# Altium schematic sheet Sheet1.SchDoc
size 400 x 500 mm; SheetNumber: 1; SheetTotal: 1; SPICEModelCacheBADZOKST: <root> / <DocumentId>BADZOKST</DocumentId> / <CacheFrame Number="0"> / <Model Name="cap" Kind="MDL"> / <Text>*Default semiconductor capacitor / .MODEL CAP C()</Text> / </Model> / </CacheFrame> / </root>
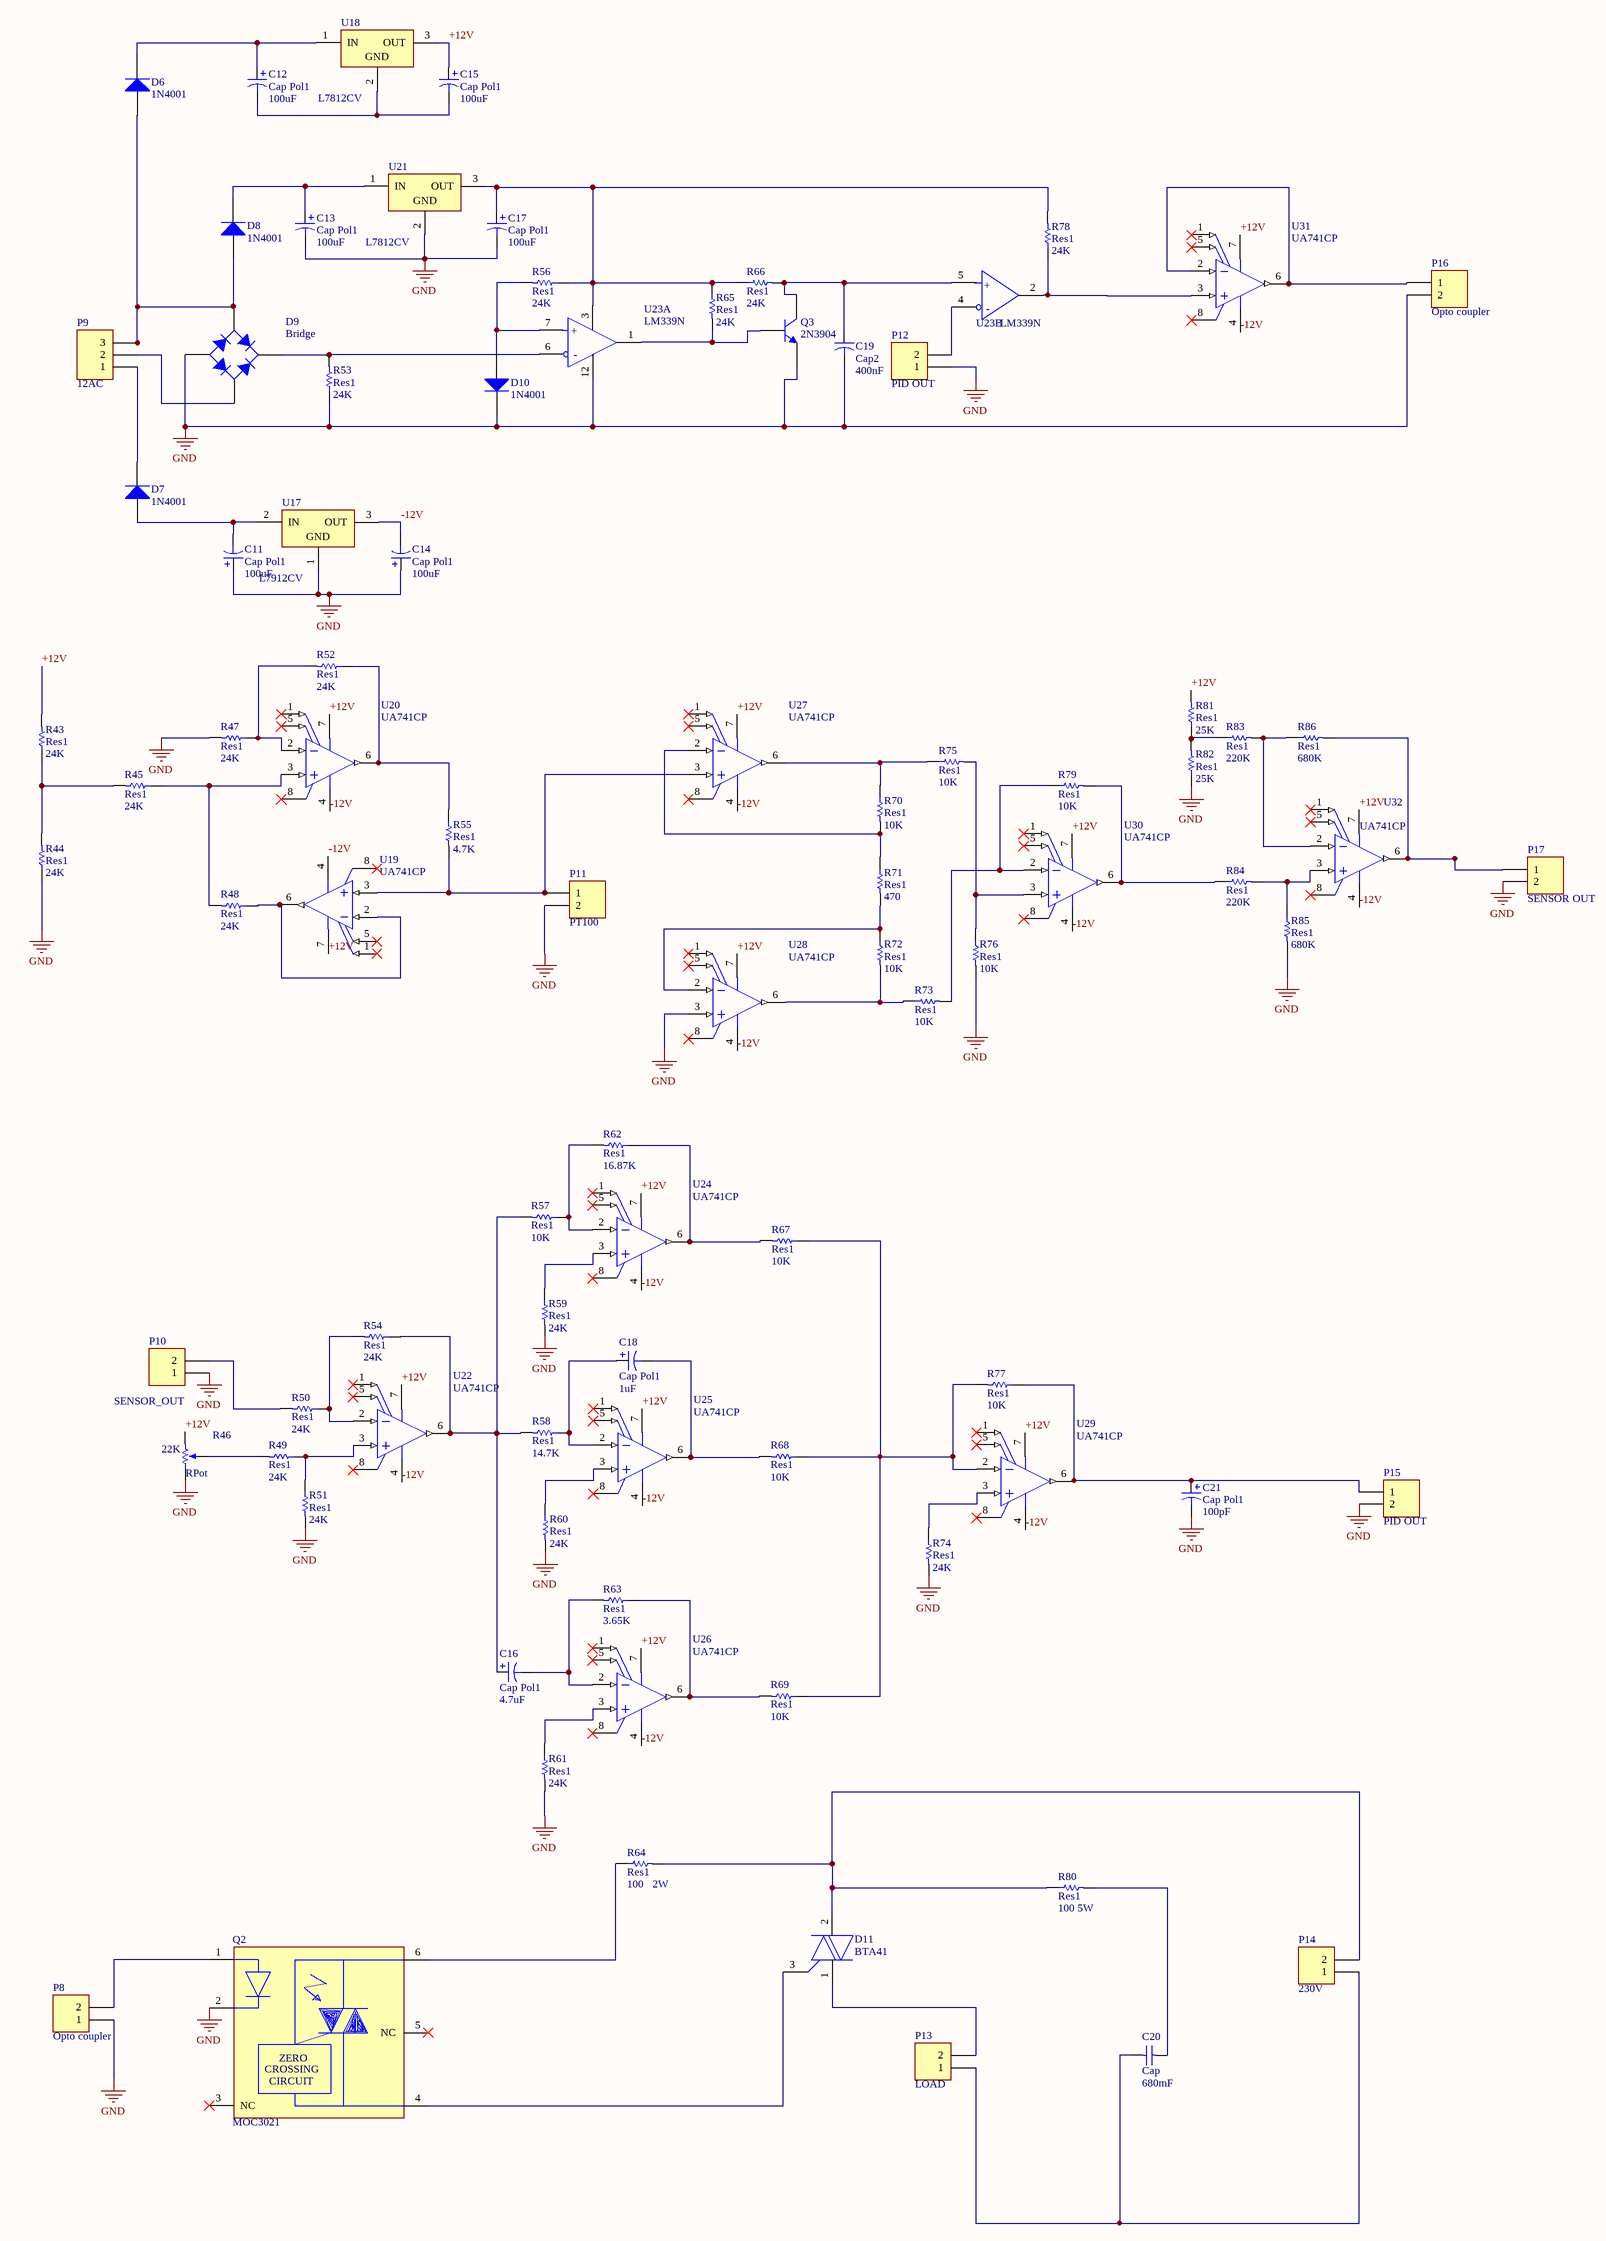
[diagram p0: Sheet1.SchDoc]

## Parts
C11  Cap Pol1  value 100uF  [RB7.6-15]
C12  Cap Pol1  value 100uF  [RB7.6-15]
C13  Cap Pol1  value 100uF  [RB7.6-15]
C14  Cap Pol1  value 100uF  [RB7.6-15]
C15  Cap Pol1  value 100uF  [RB7.6-15]
C16  Cap Pol1  value 4.7uF  [RB7.6-15]
C17  Cap Pol1  value 100uF  [RB7.6-15]
C18  Cap Pol1  value 1uF  [RB7.6-15]
C19  Cap2  value 400nF  [CAPR5-4X5]
C20  Cap  value 680mF  [RAD-0.3]
C21  Cap Pol1  value 100pF  [RB7.6-15]
D6  1N4001  [DO-41]
D7  1N4001  [DO-41]
D8  1N4001  [DO-41]
D9  Bridge  [D-38]
D10  1N4001  [DO-41]
D11  BTA41  [FP-TO-220AB-MFG]
P8  Opto coupler  [HDR1X2]
P9  12AC  [HDR1X3]
P10  SENSOR_OUT  [HDR1X2]
P11  PT100  [HDR1X2]
P12  PID OUT  [HDR1X2]
P13  LOAD  [HDR1X2]
P14  230V  [HDR1X2]
P15  PID OUT  [HDR1X2]
P16  Opto coupler  [HDR1X2]
P17  SENSOR OUT  [HDR1X2]
Q2  MOC3021  [FP-646BX-MFG]
Q3  2N3904  [ONSC-TO-92-3-29-11]
R43  Res1  value 24K  [AXIAL-0.3]
R44  Res1  value 24K  [AXIAL-0.3]
R45  Res1  value 24K  [AXIAL-0.3]
R46  RPot  value 22K  [VR5]
R47  Res1  value 24K  [AXIAL-0.3]
R48  Res1  value 24K  [AXIAL-0.3]
R49  Res1  value 24K  [AXIAL-0.3]
R50  Res1  value 24K  [AXIAL-0.3]
R51  Res1  value 24K  [AXIAL-0.3]
R52  Res1  value 24K  [AXIAL-0.3]
R53  Res1  value 24K  [AXIAL-0.3]
R54  Res1  value 24K  [AXIAL-0.3]
R55  Res1  value 4.7K  [AXIAL-0.3]
R56  Res1  value 24K  [AXIAL-0.3]
R57  Res1  value 10K  [AXIAL-0.3]
R58  Res1  value 14.7K  [AXIAL-0.3]
R59  Res1  value 24K  [AXIAL-0.3]
R60  Res1  value 24K  [AXIAL-0.3]
R61  Res1  value 24K  [AXIAL-0.3]
R62  Res1  value 16.87K  [AXIAL-0.3]
R63  Res1  value 3.65K  [AXIAL-0.3]
R64  Res1  value 100   2W  [AXIAL-0.3]
R65  Res1  value 24K  [AXIAL-0.3]
R66  Res1  value 24K  [AXIAL-0.3]
R67  Res1  value 10K  [AXIAL-0.3]
R68  Res1  value 10K  [AXIAL-0.3]
R69  Res1  value 10K  [AXIAL-0.3]
R70  Res1  value 10K  [AXIAL-0.3]
R71  Res1  value 470  [AXIAL-0.3]
R72  Res1  value 10K  [AXIAL-0.3]
R73  Res1  value 10K  [AXIAL-0.3]
R74  Res1  value 24K  [AXIAL-0.3]
R75  Res1  value 10K  [AXIAL-0.3]
R76  Res1  value 10K  [AXIAL-0.3]
R77  Res1  value 10K  [AXIAL-0.3]
R78  Res1  value 24K  [AXIAL-0.3]
R79  Res1  value 10K  [AXIAL-0.3]
R80  Res1  value 100 5W  [AXIAL-0.3]
R81  Res1  value 25K  [AXIAL-0.3]
R82  Res1  value 25K  [AXIAL-0.3]
R83  Res1  value 220K  [AXIAL-0.3]
R84  Res1  value 220K  [AXIAL-0.3]
R85  Res1  value 680K  [AXIAL-0.3]
R86  Res1  value 680K  [AXIAL-0.3]
U17  L7912CV  [TO-220]
U18  L7812CV  [TO220]
U19  UA741CP  [P0008A]
U20  UA741CP  [P0008A]
U21  L7812CV  [TO220]
U22  UA741CP  [P0008A]
U23  LM339N  [FP-N0014A-MFG]  (parts A,B of 4)
U24  UA741CP  [P0008A]
U25  UA741CP  [P0008A]
U26  UA741CP  [P0008A]
U27  UA741CP  [P0008A]
U28  UA741CP  [P0008A]
U29  UA741CP  [P0008A]
U30  UA741CP  [P0008A]
U31  UA741CP  [P0008A]
U32  UA741CP  [P0008A]

## Nets
GND: C11.1 C13.2 C14.1 C17.2 C19.2 C21.2 D9.3(A) D10.2(K) P8.1 P10.1 P11.2 P12.1 P15.2 P16.2 P17.2 Q2.2(C) Q3.1(C) R44.1 R46.1(TOP) R47.2 R51.2 R53.1 R59.2 R60.2 R61.2 R74.2 R76.2 R82.1 R85.2 U17.1(GND) U21.2(GND) U23.12(GND) U28.3(IN+)
+12V: C15.1 R43.2 R46.2(BOT) R81.2 U18.3(OUT) U19.7(VCC+) U20.7(VCC+) U22.7(VCC+) U24.7(VCC+) U25.7(VCC+) U26.7(VCC+) U27.7(VCC+) U28.7(VCC+) U29.7(VCC+) U30.7(VCC+) U31.7(VCC+) U32.7(VCC+)
-12V: C14.2 U17.3(OUT) U19.4(VCC-) U20.4(VCC-) U22.4(VCC-) U24.4(VCC-) U25.4(VCC-) U26.4(VCC-) U27.4(VCC-) U28.4(VCC-) U29.4(VCC-) U30.4(VCC-) U31.4(VCC-) U32.4(VCC-)
NetC11_2: C11.2 D7.1(A) U17.2(IN)
NetC12_1: C12.1 D6.2(K) U18.1(IN)
NetC12_2: C12.2 C15.2 U18.2(GND)
NetC13_1: C13.1 D8.2(K) U21.1(IN)
NetC16_1: C16.1 R54.1 R57.2 R58.2 U22.6(OUT)
NetC16_2: C16.2 R63.2 U26.2(IN-)
NetC17_1: C17.1 R56.1 R65.1 R66.1 R78.2 U21.3(OUT) U23.3(VCC)
NetC18_1: C18.1 R58.1 U25.2(IN-)
NetC18_2: C18.2 R68.2 U25.6(OUT)
NetC19_1: C19.1 Q3.3(E) R66.2 U23.5(2IN+)
NetC20_1: C20.1 P13.1 P14.1
NetC20_2: C20.2 R80.2
NetC21_1: C21.1 P15.1 R77.1 U29.6(OUT)
NetD6_1: D6.1(A) D8.1(A) D9.4(C) P9.3
NetD7_2: D7.2(K) P9.1
NetD9_1: D9.1(K) R53.2 U23.6(1IN-)
NetD9_2: D9.2(C) P9.2
NetD10_1: D10.1(A) R56.2 U23.7(1IN+)
NetD11_1: D11.1(A1) P13.2
NetD11_2: D11.2(A2) P14.2 R64.2 R80.1
NetD11_3: D11.3(G) Q2.4(1_MAIN_TERM.)
NetP8_2: P8.2 Q2.1(A)
NetP10_2: P10.2 R50.2
NetP11_1: P11.1 R55.2 U19.3(IN+) U27.3(IN+)
NetP12_2: P12.2 U23.4(2IN-)
NetP16_1: P16.1 U31.2(IN-) U31.6(OUT)
NetP17_1: P17.1 R86.2 U32.6(OUT)
NetQ2_6: Q2.6(2_MAIN_TERM.) R64.1
NetQ3_2: Q3.2(B) R65.2 U23.1(1OUT)
NetR43_1: R43.1 R44.2 R45.2
NetR45_1: R45.1 R48.2 U20.3(IN+)
NetR46_3: R46.3(TAP) R49.2
NetR47_1: R47.1 R52.2 U20.2(IN-)
NetR48_1: R48.1 U19.2(IN-) U19.6(OUT)
NetR49_1: R49.1 R51.1 U22.3(IN+)
NetR50_1: R50.1 R54.2 U22.2(IN-)
NetR52_1: R52.1 R55.1 U20.6(OUT)
NetR57_1: R57.1 R62.2 U24.2(IN-)
NetR59_1: R59.1 U24.3(IN+)
NetR60_1: R60.1 U25.3(IN+)
NetR61_1: R61.1 U26.3(IN+)
NetR62_1: R62.1 R67.2 U24.6(OUT)
NetR63_1: R63.1 R69.2 U26.6(OUT)
NetR67_1: R67.1 R68.1 R69.1 R77.2 U29.2(IN-)
NetR70_1: R70.1 R75.1 U27.6(OUT)
NetR70_2: R70.2 R71.1 U27.2(IN-)
NetR71_2: R71.2 R72.1 U28.2(IN-)
NetR72_2: R72.2 R73.1 U28.6(OUT)
NetR73_2: R73.2 R79.1 U30.2(IN-)
NetR74_1: R74.1 U29.3(IN+)
NetR75_2: R75.2 R76.1 U30.3(IN+)
NetR78_1: R78.1 U23.2(2OUT) U31.3(IN+)
NetR79_2: R79.2 R84.1 U30.6(OUT)
NetR81_1: R81.1 R82.2 R83.1
NetR83_2: R83.2 R86.1 U32.2(IN-)
NetR84_2: R84.2 R85.1 U32.3(IN+)

Not connected (* = marked no-connect by the designer): Q2 3(NC)* 5(NC)*; U19 1(OFFSET_N1)* 5(OFFSET_N2)* 8(NC)*; U20 1(OFFSET_N1)* 5(OFFSET_N2)* 8(NC)*; U22 1(OFFSET_N1)* 5(OFFSET_N2)* 8(NC)*; U24 1(OFFSET_N1)* 5(OFFSET_N2)* 8(NC)*; U25 1(OFFSET_N1)* 5(OFFSET_N2)* 8(NC)*; U26 1(OFFSET_N1)* 5(OFFSET_N2)* 8(NC)*; U27 1(OFFSET_N1)* 5(OFFSET_N2)* 8(NC)*; U28 1(OFFSET_N1)* 5(OFFSET_N2)* 8(NC)*; U29 1(OFFSET_N1)* 5(OFFSET_N2)* 8(NC)*; U30 1(OFFSET_N1)* 5(OFFSET_N2)* 8(NC)*; U31 1(OFFSET_N1)* 5(OFFSET_N2)* 8(NC)*; U32 1(OFFSET_N1)* 5(OFFSET_N2)* 8(NC)*

## Notes on the sheet
- (in symbol CMP-0055-00143-4, part A) +; -
- (in symbol CMP-0055-00143-4, part B) +; -
- (in symbol CMP-07144-000005-1) ZERO; CROSSING; CIRCUIT

## Library data of the parts
C11-C18 C21 = Cap Pol1: Polarized Capacitor (Radial); Published: 8-Jun-2000; LatestRevisionDate: 17-Jul-2002; LatestRevisionNote: Re-released for DXP Platform.; PackageReference: RB7.6-15; Publisher: Altium Limited; PackageDescription: Polarized Capacitor (Radial); 2 Leads
C19 = Cap2: Capacitor; Published: 23-Sep-2002; PackageReference: CAPR5-4X5; Publisher: Altium Limited; PackageDescription: Capacitor; 2 Leads
C20 = Cap: Capacitor; Published: 8-Jun-2000; LatestRevisionDate: 17-Jul-2002; LatestRevisionNote: Re-released for DXP Platform.; PackageReference: RAD-0.3; Publisher: Altium Limited; PackageDescription: Radial Cap, Thru-Hole; 2 Leads; 0.3 in Pin Spacing
D6-D8 D10 = Diode 1N4001: 1 Amp General Purpose Rectifier; Published: 8-Jun-2000; LatestRevisionDate: 17-Jul-2002; LatestRevisionNote: Re-released for DXP Platform.; DatasheetVersion: 1998; PackageVersion: Aug-1999; PackageReference: DO-41; Publisher: Altium Limited; PackageDescription: Diode, Axial; Body 5.2 x 2.7 mm (LxDia. max), Lead Dia. 0.86 mm (max); Code_JEDEC: DO-204-AL; ComponentLink1Description: Manufacturer Link; ComponentLink1URL: http://www.fairchildsemi.com/; ComponentLink2Description: Datasheet; ComponentLink2URL: http://www.fairchildsemi.com/ds/1N%2F1N4001.pdf
D9 = Bridge1: Full Wave Diode Bridge; Published: 8-Jun-2000; LatestRevisionDate: 29-May-2009; LatestRevisionNote: Sch pins A & K swapped.; DatasheetVersion: E2732B; PackageReference: D-38; Publisher: Altium Limited; PackageDescription: Bridge Rectifier; 4 Terminals; Body 9.4 x 9.4 mm (typ); Pitch 5.08 mm
D11 = CMP-12193-000008-1: TRIAC ALTERNISTOR 600V TO220AB; Manufacturer: STMicroelectronics; Manufacturer Part Number: BTA24-600BWRG; On State Current Rms: 25A; Max Junction Temp: +125°C; Hold Current: 75mA; Gate Trigger Voltage: 1.3V; Gate Trigger Current: 50mA; Standoff Height: 3.75mm; Forward Voltage: 1.55V; Off State Voltage: 600V; Category: Diode; Temperature Range Low: -40°C; ComponentLink2URL: https://www.st.com/resource/en/datasheet/bta24.pdf; Temperature: -40°C to +125°C; ComponentLink2Description: Datasheet; Automotive: No; Lead Free: Yes; Mouser Description: Triacs 25 Amp 600 Volt; Temperature Range High: +125°C; Digikey Description: TRIAC ALTERNISTOR 600V TO220AB; Octopart: https://octopart.com/bta24-600bwrg-stmicroelectronics-360258; RoHS: TRUE; Device Class L2: Thyristors; Height: 19.65mm; Device Class L1: Discrete Semiconductors; Device Class L3: TRIACs; Package: TO-220AB
P8 P10-P17 = Header 2: Header, 2-Pin; LatestRevisionDate: 17-Jul-2002; LatestRevisionNote: Re-released for DXP Platform.; Publisher: Altium Limited
P9 = Header 3: Header, 3-Pin; LatestRevisionDate: 17-Jul-2002; LatestRevisionNote: Re-released for DXP Platform.; Publisher: Altium Limited
Q2 = CMP-07144-000005-1: OPTOISOLATOR 4.17KV TRIAC 6DIP; Manufacturer Part Number: MOC3041M; Manufacturer: ON Semiconductor; Forward Voltage: 1.25V; Power Dissipation: 250mW; Forward Current: 30mA; Reverse Voltage: 6V; Max Junction Temp: +100°C; Isolation Voltage: 4170Vrms; Standoff Height: 0.38mm; Octopart: https://octopart.com/moc3041m-on+semiconductor-84330395; Temperature Range Low: -40°C; Category: Trans; Package: 646BX; Height: 5.08mm; ComponentLink2Description: Datasheet; Device Class L2: Optocouplers; Device Class L1: Optoelectronics; Device Class L3: unset; Automotive: No; RoHS: TRUE; Mouser Description: Optocoupler Triac AC Output 1 Channel 400VDRM 6-Pin Plastic Dip White Bulk; Temperature: -40°C to +85°C; Lead Free: Yes; ComponentLink2URL: https://www.onsemi.com/pub/Collateral/MOC3043M-D.pdf; Digikey Description: OPTOISOLATOR 4.17KV TRIAC 6DIP; Temperature Range High: +85°C; Footprint Url: https://www.onsemi.com/pub/Collateral/646BX.PDF
Q3 = NPN: NPN Bipolar Transistor; Published: 8-Jun-2000; LatestRevisionDate: 17-Jul-2002; LatestRevisionNote: Re-released for DXP Platform.; PackageReference: TO-226-AA; Publisher: Altium Limited; PackageDescription: TO, Flat Index; 3 In-Line, Axial Leads; Body Dia. 4.8mm; Leads 0.55 x 0.51 mm (max); Code_JEDEC: TO-226-AA
R43-R45 R47-R86 = Res1: Resistor; Published: 8-Jun-2000; LatestRevisionDate: 17-Jul-2002; LatestRevisionNote: Re-released for DXP Platform.; PackageReference: AXIAL-0.3; Publisher: Altium Limited; PackageDescription: Axial Device, Thru-Hole; 2 Leads; 0.3 in Pin Spacing
R46 = RPot: Potentiometer; Sim Note: Enter the Resistance value and the set point into parameter fields.; Set Position: 0.5; Published: 8-Jun-2000; LatestRevisionDate: 17-Jul-2002; LatestRevisionNote: Re-released for DXP Platform.; PackageReference: VR5; Publisher: Altium Limited; PackageDescription: Variable Resistor, Thru-Hole; 3 Leads
U17 = CMP-0244-00457-1: Negative Voltage Regulator, -12V, 3-Pin TO-220; PackageReference: TO-220; PackageVersion: 2011; PackageDescription: TO, Thru-Hole, Vertical, Heatsink Mounted; 3 In-Line Leads; Pitch 2.54 mm; ComponentLink1Description: Manufacturer URL; ComponentLink2URL: http://www.st.com/internet/com/TECHNICAL_RESOURCES/TECHNICAL_LITERATURE/DATASHEET/CD00000450.pdf; ComponentLink2Description: Datasheet; ComponentLink1URL: http://www.st.com; DatasheetVersion: 1/11/2011
U18 U21 = CMP-0244-00450-1: Positive Voltage Regulator, 12V, 3-Pin TO-220; PackageDescription: TO, Thru-Hole, Vertical, Heatsink Mounted; 3 In-Line Leads; Pitch 2.54 mm; ComponentLink3URL: http://www.st.com/internet/com/TECHNICAL_RESOURCES/TECHNICAL_LITERATURE/PACKAGE_INFORMATION/CD00004649.pdf; ComponentLink1URL: http://www.st.com; ComponentLink2Description: Datasheet; ComponentLink3Description: Package Specification; ComponentLink2URL: http://www.st.com/internet/com/TECHNICAL_RESOURCES/TECHNICAL_LITERATURE/DATASHEET/CD00000444.pdf; DatasheetVersion: 16/11/2011; PackageVersion: ver3.0; PackageReference: TO220; ComponentLink1Description: Manufacturer URL
U19 U20 U22 U24-U32 = CMP-0017-00973-2: General-Purpose Operational Amplifier, 7 to 36 V, 0 to 70 degC, 8-pin DIP (P8), Pb-Free (RoHS); Manufacturer: Texas Instruments; Iq per channel(Max)(mA): 2.8; Number of Channels: 1; Total Supply Voltage(Min)(+5V is 5, +/-5V is 10): 7; IIB(Max)(pA): 800000; Slew Rate(Typ)(V/us): 0.5; Total Supply Voltage(Max)(+5V is 5, +/-5V is 10): 36; Vio (25C)(Max)(mV): 6; CMRR(Min)(dB): 70; Sub Family: General Purpose Amplifier, High Supply Voltage Amplifier (>=30V); PackageVersion: 4040082/E, 04/2010; PackageReference: P0008A; ComponentLink1URL: http://www.ti.com/; Mounting Technology: Through Hole; ComponentLink1Description: Manufacturer URL; GBW(Typ)(MHz): 1; ComponentLink2Description: Datasheet; ComponentLink2URL: http://www.ti.com/lit/ds/symlink/ua741.pdf; PartNumber: UA741CP; Code_JEDEC: MS-001; ComponentLink3Description: Package Specification; DatasheetVersion: SLOS094B; ComponentLink3URL: http://www.ti.com/litv/pdf/mpdi001b; PackageDescription: 8-Pin Plastic In-Line, Body 9.59 x 6.35 mm, Pitch 2.54 mm; Eco-Plan: Pb-Free (RoHS)
U23 = CMP-0055-00143-4: IC QUAD DIFF COMPARATOR 14-DIP; Power Dissipation: 1.05kW; Response Time: 1.3us; Max Input Current: 250nA; Max Supply Current: 500uA; Output Current: 20mA; Output Type: TTL; Max Dual Supply Voltage: 15V; Voltage Gain: 106.02dB; Min Supply Voltage: 2V; Max Power Dissipation: 1.05W; Quiescent Current: 2.5mA; Nominal Supply Current: 2mA; Input Offset Voltage (Vos): 5mV; Number of Channels: 4; Output Current per Channel: 6mA; Max Supply Voltage: 30V; Min Dual Supply Voltage: 1V; Dual Supply Voltage: 9V; REACH SVHC: No SVHC; Max Operating Temperature: 70°C; Case/Package: PDIP; Weight: 0.032734oz; Radiation Hardening: No; Min Operating Temperature: 0°C; Number of Pins: 14; Contact Plating: Gold; Package Quantity: 25; Lead Free: Lead Free; Height: 4.57mm; Packaging: Rail/Tube; Input Bias Current: 250nA; Number of Elements: 4; Mount: Through Hole; Width: 6.35mm; Length: 19.3mm